# EAGLE design Micro Control Board - V130 (EAGLE 7.7.0)
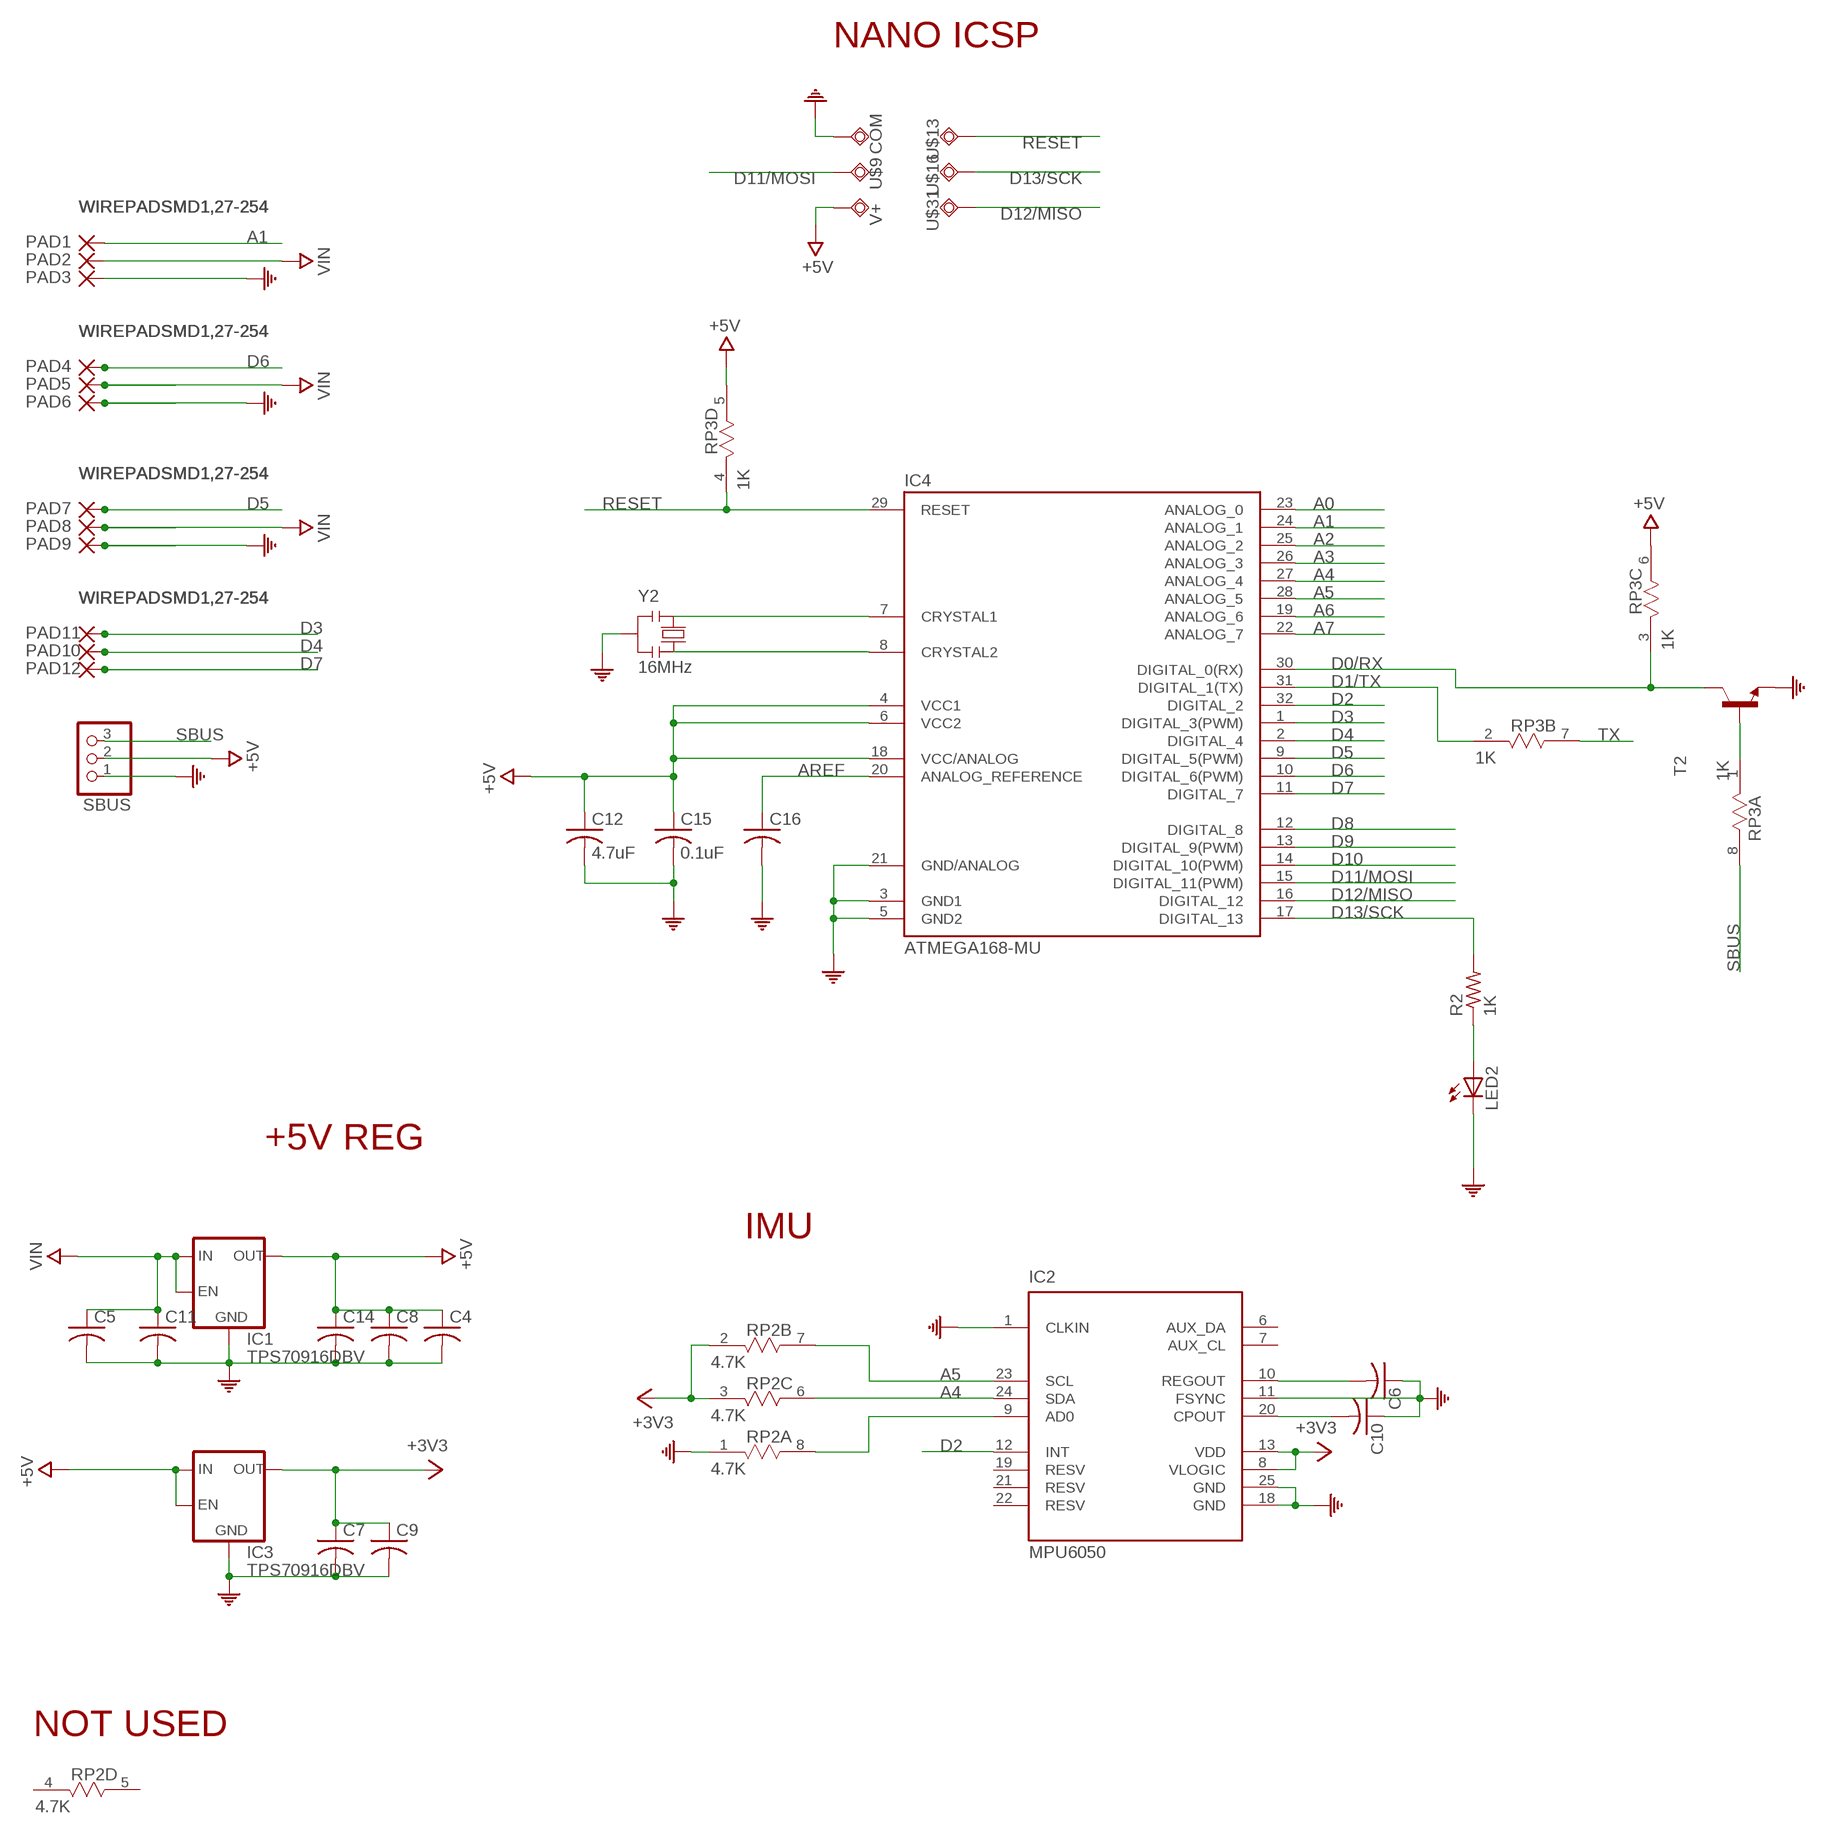
[diagram p0: schematic, sheet 1]

## Parts
C4  C-USC0402  [C0402]
C5  C-USC0402  [C0402]
C6  C-USC0402  [C0402]
C7  C-USC0402  [C0402]
C8  C-USC0402  [C0402]
C9  C-USC0402  [C0402]
C10  C-USC0402  [C0402]
C11  C-USC0402  [C0402]
C12  4.7uF  C-USC0402  [C0402]
C14  C-USC0402  [C0402]
C15  0.1uF  C-USC0402  [C0402]
C16  C-USC0402  [C0402]
COM  0.7MM-THRU  [0.65MM-THRU]
IC1  TPS70916DBV  [SOT23-5]
IC2  MPU6050  [QFN50P400X400X95-25T265X275N]
IC3  TPS70916DBV  [SOT23-5]
IC4  ATMEGA168-MU  [MLF32]
LED2  LEDCHIP-LED0603  [CHIP-LED0603]
PAD1  WIREPADSMD1,27-254  [SMD1,27-2,54]
PAD2  WIREPADSMD1,27-254  [SMD1,27-2,54]
PAD3  WIREPADSMD1,27-254  [SMD1,27-2,54]
PAD4  WIREPADSMD1,27-254  [SMD1,27-2,54]
PAD5  WIREPADSMD1,27-254  [SMD1,27-2,54]
PAD6  WIREPADSMD1,27-254  [SMD1,27-2,54]
PAD7  WIREPADSMD1,27-254  [SMD1,27-2,54]
PAD8  WIREPADSMD1,27-254  [SMD1,27-2,54]
PAD9  WIREPADSMD1,27-254  [SMD1,27-2,54]
PAD10  WIREPADSMD1,27-254  [SMD1,27-2,54]
PAD11  WIREPADSMD1,27-254  [SMD1,27-2,54]
PAD12  WIREPADSMD1,27-254  [SMD1,27-2,54]
R2  1K  R-US_R0402  [R0402]
RP2  4.7K  RES4NT  [RES4NT]
RP3  1K  RES4NT  [RES4NT]
SBUS  PINHD-1X3  [1X03]
T2  MMBT3904LT1-NPN-SOT23-BEC  [SOT23-BEC]
U$9  0.7MM-THRU  [0.65MM-THRU]
U$13  0.7MM-THRU  [0.65MM-THRU]
U$16  0.7MM-THRU  [0.65MM-THRU]
U$31  0.7MM-THRU  [0.65MM-THRU]
V+  0.7MM-THRU  [0.65MM-THRU]
Y2  16MHz  RESONATORMU  [RESONATOR]

## Nets
+3V3: C7.1 C9.1 IC2.8(VLOGIC) IC2.13(VDD) IC3.5(OUT) RP2.2 RP2.3
+5V: C4.1 C8.1 C12.1 C14.1 C15.1 IC1.5(OUT) IC3.1(IN) IC3.3(EN) IC4.4(VCC1) IC4.6(VCC2) IC4.18(VCC/ANALOG) RP3.5 RP3.6 SBUS.2 V+.P$2(TP)
A0: IC4.23(ANALOG_0)
A1: IC4.24(ANALOG_1) PAD1.1(P)
A2: IC4.25(ANALOG_2)
A3: IC4.26(ANALOG_3)
A4: IC2.24(SDA) IC4.27(ANALOG_4) RP2.6
A5: IC2.23(SCL) IC4.28(ANALOG_5) RP2.7
A6: IC4.19(ANALOG_6)
A7: IC4.22(ANALOG_7)
AREF: C16.1 IC4.20(ANALOG_REFERENCE)
COM: C4.2 C5.2 C6.1 C7.2 C8.2 C9.2 C10.1 C11.2 C12.2 C14.2 C15.2 C16.2 COM.P$2(TP) IC1.2(GND) IC2.1(CLKIN) IC2.11(FSYNC) IC2.18(GND) IC2.25(GND) IC3.2(GND) IC4.3(GND1) IC4.5(GND2) IC4.21(GND/ANALOG) LED2.C PAD3.1(P) PAD6.1(P) PAD9.1(P) RP2.1 SBUS.1 T2.E Y2.2
D0/RX: IC4.30(DIGITAL_0(RX)) RP3.3 T2.C
D1/TX: IC4.31(DIGITAL_1(TX)) RP3.2
D2: IC2.12(INT) IC4.32(DIGITAL_2)
D3: IC4.1(DIGITAL_3(PWM)) PAD10.1(P)
D4: IC4.2(DIGITAL_4) PAD11.1(P)
D5: IC4.9(DIGITAL_5(PWM)) PAD7.1(P)
D6: IC4.10(DIGITAL_6(PWM)) PAD4.1(P)
D7: IC4.11(DIGITAL_7) PAD12.1(P)
D8: IC4.12(DIGITAL_8)
D9: IC4.13(DIGITAL_9(PWM))
D10: IC4.14(DIGITAL_10(PWM))
D11/MOSI: IC4.15(DIGITAL_11(PWM)) U$9.P$2(TP)
D12/MISO: IC4.16(DIGITAL_12) U$31.P$2(TP)
D13/SCK: IC4.17(DIGITAL_13) R2.2 U$16.P$2(TP)
N$3: IC2.9(AD0) RP2.8
N$4: C6.2 IC2.10(REGOUT)
N$5: IC4.7(CRYSTAL1) Y2.1
N$6: C10.2 IC2.20(CPOUT)
N$7: IC4.8(CRYSTAL2) Y2.3
N$8: LED2.A R2.1
N$9: RP3.1 T2.B
RESET: IC4.29(RESET) RP3.4 U$13.P$2(TP)
SBUS: RP3.8 SBUS.3
TX: RP3.7
VIN: C5.1 C11.1 IC1.1(IN) IC1.3(EN) PAD2.1(P) PAD5.1(P) PAD8.1(P)
Unconnected: IC2.2(NC) IC2.3(NC) IC2.4(NC) IC2.5(NC) IC2.6(AUX_DA) IC2.7(AUX_CL) IC2.14(NC) IC2.15(NC) IC2.16(NC) IC2.17(NC) IC2.19(RESV) IC2.21(RESV) IC2.22(RESV) RP2.4 RP2.5

## Notes on the sheet
- NANO ICSP
- +5V REG
- IMU
- NOT USED

## Library data of the parts
C4-C12 C14-C16 = resistor:C-US: CAPACITOR, American symbol
COM U$9 U$13 U$16 U$31 V+ = testpad:0.7MM-THRU
IC1 IC3 = tps709xx_10:TPS709*: TPS709xx 150-mA, 30-V, 1-μA IQ Voltage Regulators with Enable Source: http://www.ti.com/lit/ds/symlink/tps709.pdf; MF: Texas Instruments; MPN: TPS70916DBVT; OC_FARNELL: 2314371; OC_NEWARK: 69W6893
IC2 = invensense:MPU6050: The triple-axis MEMS gyroscope
IC4 = Arduino-AVR:ATMEGA168
LED2 = led:LED: LED OSRAM: - CHIPLED LG R971, LG N971, LY N971, LG Q971, LY Q971, LO R971, LY R971 LH N974, LH R974 LS Q976, LO Q976, LY Q976 LO Q996 - Hyper CHIPLED LW Q18S LB Q993, LB Q99A, LB R99A - SideLED LS A670, LO A670, LY A670, LG A670, LP A670 LB A673, LV A673, LT A673, LW A673 LH A674 LY A675 LS A676, LA A676, LO A676, LY A676, LW A676 LS A679, LY A679, LG A679 - Hyper Micro SIDELED® LS Y876, LA Y876, LO Y876, LY Y876 LT Y87S - SmartLED LW L88C, LW L88S LB L89C, LB L89S, LG L890 LS L89K, LO L89K, LY L89K LS L896, LA L896, LO L896, LY L896 - TOPLED LS T670, LO T670, LY T670, LG T670, LP T670 LSG T670, LSP T670, LSY T670, LOP T670, LYG T670 LG T671, LOG T671, LSG T671 LB T673, LV T673, LT T673, LW T673 LH T674 LS T676, LA T676, LO T676, LY T676, LB T676, LH T676, LSB T676, LW T676 LB T67C, LV T67C, LT T67C, LS T67K, LO T67K, LY T67K, LW E67C LS E67B, LA E67B, LO E67B, LY E67B, LB E67C, LV E67C, LT E67C LW T67C LS T679, LY T679, LG T679 LS T770, LO T770, LY T770, LG T770, LP T770 LB T773, LV T773, LT T773, LW T773 LH T774 LS E675, LA E675, LY E675, LS T675 LS T776, LA T776, LO T776, LY T776, LB T776 LHGB T686 LT T68C, LB T68C - Hyper Mini TOPLED® LB M676 - Mini TOPLED Santana® LG M470 LS M47K, LO M47K, LY M47K Source: http://www.osram.convergy.de LUXEON: - LUMILED® LXK2-PW12-R00, LXK2-PW12-S00, LXK2-PW14-U00, LXK2-PW14-V00 LXK2-PM12-R00, LXK2-PM12-S00, LXK2-PM14-U00 LXK2-PE12-Q00, LXK2-PE12-R00, LXK2-PE12-S00, LXK2-PE14-T00, LXK2-PE14-U00 LXK2-PB12-K00, LXK2-PB12-L00, LXK2-PB12-M00, LXK2-PB14-N00, LXK2-PB14-P00, LXK2-PB14-Q00 LXK2-PR12-L00, LXK2-PR12-M00, LXK2-PR14-Q00, LXK2-PR14-R00 LXK2-PD12-Q00, LXK2-PD12-R00, LXK2-PD12-S00 LXK2-PH12-R00, LXK2-PH12-S00 LXK2-PL12-P00, LXK2-PL12-Q00, LXK2-PL12-R00 Source: www.luxeon.com KINGBRIGHT: KA-3528ASYC Source: www.kingbright.com
PAD1-PAD12 = wirepad:WIREPAD: Wire PAD connect wire on PCB
R2 = resistor:R-US_: RESISTOR, American symbol
RP2 RP3 = MySMD:RES4NT
SBUS = pinhead:PINHD-1X3: PIN HEADER
T2 = transistor-neu-to92:*-NPN-: NPN Transistror
Y2 = MySMD2:RESONATOR

## Board
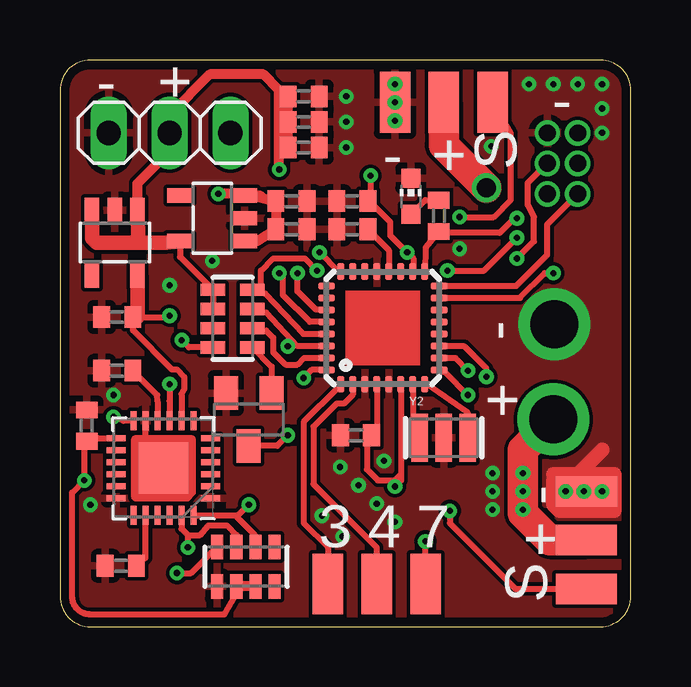
[diagram p1: board, top side]
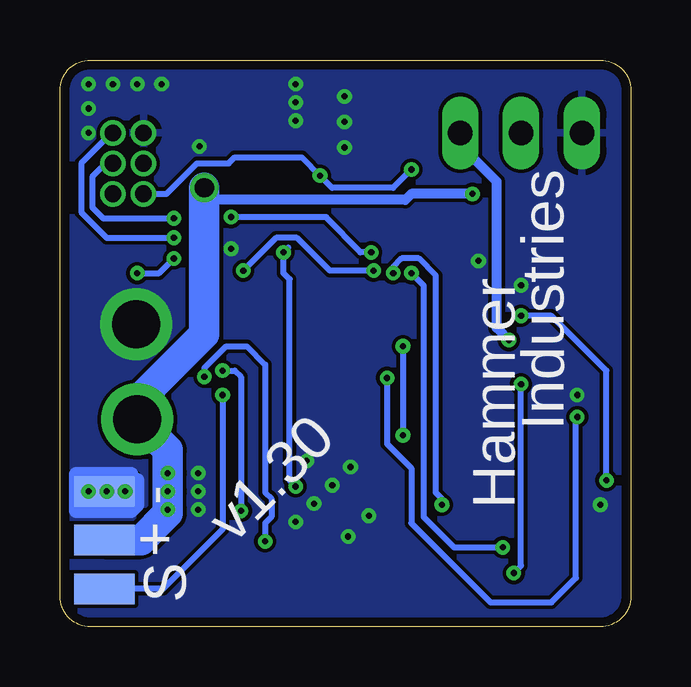
[diagram p2: board, bottom side, seen from below]

Size 23.8 x 23.61 mm. Coordinates in mm from the lower left corner, seen from the top.
Outline: 1.27,0 22.53,0 arc90 23.8,1.27 23.8,22.34 arc90 22.53,23.61 1.27,23.61 arc90 0,22.34 0,1.27 arc90 1.27,0
Copper layers (1*16): Top 0.0356mm / dielectric 1.5011mm / Bottom 0.0356mm
Design rules "oshpark-2layer *": minimum track width 6mil, minimum drill 10mil, track to track 6mil, track to pad 6mil, pad to pad 6mil, via to via 6mil, smd to smd 6mil, copper to edge 15mil, drill to drill 6mil, minimum pad ring 7mil, minimum via ring 7mil, stop-mask expansion 2.5mil, vias tented up to drill 25mil, thermal gap 10mil

### Footprints (pad centres in the part's own frame; a part is rotated, then mirrored left to right if it is on the bottom)
C0402 = smd 0.7 x 0.9: 1 -0.65,0; 2 0.65,0
0.65MM-THRU = drill 0.7 pad 1.016: P$2 0,0
SOT23-5 = smd 0.6 x 1.05: 1 -0.95,-1.35; 2 0,-1.35; 3 0.95,-1.35; 4 0.95,1.35; 5 -0.95,1.35
QFN50P400X400X95-25T265X275N = smd 0.26 x 0.79: 1 -1.25,-1.97; 2 -0.75,-1.97; 3 -0.25,-1.97; 4 0.25,-1.97; 5 0.75,-1.97; 6 1.25,-1.97; 13 1.25,1.97; 14 0.75,1.97; 15 0.25,1.97; 16 -0.25,1.97; 17 -0.75,1.97; 18 -1.25,1.97 | smd 0.79 x 0.26: 7 1.97,-1.25; 8 1.97,-0.75; 9 1.97,-0.25; 10 1.97,0.25; 11 1.97,0.75; 12 1.97,1.25; 19 -1.97,1.25; 20 -1.97,0.75; 21 -1.97,0.25; 22 -1.97,-0.25; 23 -1.97,-0.75; 24 -1.97,-1.25 | smd 2.15 x 2.05: 25 0,0
MLF32 = smd 0.7 x 0.3: 1 -2.35,1.75; 2 -2.35,1.25; 3 -2.35,0.75; 4 -2.35,0.25; 5 -2.35,-0.25; 6 -2.35,-0.75; 7 -2.35,-1.25; 8 -2.35,-1.75; 17 2.35,-1.75; 18 2.35,-1.25; 19 2.35,-0.75; 20 2.35,-0.25; 21 2.35,0.25; 22 2.35,0.75; 23 2.35,1.25; 24 2.35,1.75 | smd 0.3 x 0.7: 9 -1.75,-2.35; 10 -1.25,-2.35; 11 -0.75,-2.35; 12 -0.25,-2.35; 13 0.25,-2.35; 14 0.75,-2.35; 15 1.25,-2.35; 16 1.75,-2.35; 25 1.75,2.35; 26 1.25,2.35; 27 0.75,2.35; 28 0.25,2.35; 29 -0.25,2.35; 30 -0.75,2.35; 31 -1.25,2.35; 32 -1.75,2.35
CHIP-LED0603 = smd 0.8 x 0.8: A 0,-0.75; C 0,0.75
SMD1,27-2,54 = smd 1.27 x 2.54: 1 0,0
R0402 = smd 0.7 x 0.9: 1 -0.65,0; 2 0.65,0
RES4NT = smd 0.508 x 1.016: 1 0,0; 2 0.8,0; 3 1.6,0; 4 2.4,0; 5 2.4,1.651; 6 1.6,1.651; 7 0.8,1.651; 8 0,1.651
1X03 = drill 1.016 long: 1 -2.54,0; 2 0,0; 3 2.54,0
SOT23-BEC = smd 1 x 1.4: B -0.95,-1.1; C 0,1.1; E 0.95,-1.1
RESONATOR = smd 0.7 x 2: 1 -1,0; 2 0,0; 3 1,0

### Placement (x,y rotation side)
C4  10.16,19.96 0 top
C5  9.65,16.56 0 top
C6  2.39,10.67 0 top
C7  2.39,12.9 180 top
C8  10.16,21.03 0 top
C9  1.12,8.38 90 top
C10  2.54,2.54 0 top
C11  9.65,17.73 0 top
C12  12.34,7.98 180 top
C14  10.16,22.1 0 top
C15  12.19,17.73 180 top
C16  12.19,16.56 180 top
COM  20.32,20.57 0 top
IC1  6.35,17.02 90 top
IC2  4.32,6.6 90 top
IC3  2.29,16 180 top
IC4  13.46,12.45 90 top
LED2  14.63,17.93 0 top
PAD1  18.03,21.84 0 top
PAD2  16,21.84 0 top
PAD3  13.97,21.84 0 top
PAD4  21.95,1.57 90 top
PAD5  21.95,3.61 90 top
PAD6  21.95,5.64 90 top
PAD7  21.95,1.57 90 bottom
PAD8  21.95,3.61 90 bottom
PAD9  21.95,5.64 90 bottom
PAD10  11.18,1.78 0 top
PAD11  13.21,1.78 0 top
PAD12  15.24,1.78 0 top
R2  15.8,17.12 270 top
RP2  6.55,1.68 0 top
RP3  8.03,11.63 90 top
SBUS  4.57,20.57 0 top
T2  7.87,8.64 180 top
U$9  20.32,19.3 0 top
U$13  21.59,20.57 0 top
U$16  21.59,19.3 0 top
U$31  21.59,18.03 0 top
V+  20.32,18.03 0 top
Y2  16,7.87 0 top

### Tracks (layer width: path | path; a pad name or v marks a point on that pad's centre or on a via)
+3V3  (via drill 0.25)
  Top 0.254: IC2.13 1.59,7.85 C9.1 1.02,7.43 v1.02,6.1 0.51,5.59 0.51,1.27 arc90 1.27,0.51 6.86,0.51 7.37,1.37 7.37,1.66 RP2.2 | IC2.8 5.07,9.69 5.18,9.91 5.18,10.41 4.88,10.72 4.66,10.72 3.05,12.34 3.04,12.46 C7.1 4.52,12.9 v4.57,12.95
  Top 0.406: RP2.3 RP2.2
  Top 0.61: IC3.5 3.24,12.9 C7.1
  Bottom 0.254: v1.02,6.1 1.02,10.67 3.3,12.95 v4.57,12.95
+5V  (via drill 0.25)
  Top 0.254: IC4.4 13.21,8.27 C12.1 12.8,7.88 12.8,6.55 13.26,6.1 13.97,6.1 14.22,6.35 | IC4.6 14.22,10.08 14.22,6.35 | 14.22,6.35 14.22,6.1 v13.97,5.84 | C15.1 12.9,17.73 | 12.9,17.73 13.77,16.87 13.77,16.31 v14.48,15.6 14.73,15.34 14.73,14.82 IC4.18 | RP3.6 RP3.5 5,15.41 IC1.5 | v12.95,18.8 12.95,17.87 12.9,17.82 12.9,17.73
  Top 0.406: IC3.1 3.24,18.48 4.57,19.81 SBUS.2 4.57,21.34 6.25,23.01 8.48,23.01 9.14,22.35 | C4.1 C8.1 C14.1 9.4,21.59 9.14,22.35 | v9.14,19.05 9.14,22.35
  Top 0.61: IC3.3 1.34,16.19 1.52,16 3.25,16 | 3.25,16 3.25,16.07 IC3.1 | 3.25,16 4.43,16 IC1.5
  Bottom 0.254: v9.14,19.05 9.91,18.29 12.45,18.29 v12.95,18.8 13.72,19.56 16.51,19.56 16.76,19.3 18.09,19.3 19.36,18.03 V+.P$2 | v13.97,5.84 14.22,6.1 14.22,14.48 14.48,14.73 v14.48,15.6 14.28,15.8
A1  (via drill 0.25)
  Top 0.254: IC4.24 11.62,14.8 v10.82,15.6 | v16.66,17.07 18.09,17.07 18.8,17.78 18.8,20.57 PAD1.1
  Bottom 0.254: v10.82,15.6 11.28,15.6 12.7,17.07 v16.66,17.07
A4  (via drill 0.25)
  Top 0.254: IC2.24 7.3,4.63 | 7.3,4.63 8.13,3.81 8.13,3.1 RP2.6 | 7.3,4.63 7.43,4.63 v7.87,5.08 | IC4.27 10.67,13.21 9.91,13.97 v9.91,14.73
  Bottom 0.254: v7.87,5.08 7.87,5.33 8.13,5.59 8.13,14.63 8.84,15.34 9.55,15.34 9.91,14.99 v9.91,14.73
A5  (via drill 0.25)
  Top 0.254: IC2.23 5.07,4.08 5.33,3.81 | 5.33,3.81 5.84,3.81 6.2,4.22 6.96,4.22 7.37,3.81 7.37,3.09 RP2.7 | IC4.28 10.42,12.7 9.3,13.82 9.3,14.58 v9.14,14.73 | v5.33,3.3 5.33,3.81
  Bottom 0.254: v9.14,14.73 8.64,14.22 8.64,4.57 7.37,3.3 v5.33,3.3
AREF
  Top 0.254: C16.1 13.71,15.69 IC4.20
COM  (via drill 0.25, 2)
  Top 0.254: IC2.11 3.56,8.56 3.56,7.37 IC2.25
  Top 0.61: 21.59,6.35 23.11,6.35 23.11,4.83 20.83,4.83 20.57,5.08 20.57,6.1 | 20.57,6.35 21.59,6.35 | 21.59,6.35 22.61,7.37
  Bottom 0.61: 20.83,6.35 23.11,6.35 23.11,4.83 20.83,4.83 20.57,5.08 20.57,6.1 21.03,5.64 v21.08,5.64
  other vias: 20.62,12.6 2.24,9.65 1.27,5.08 4.57,14.22 13.51,6.91 10.92,4.62 11.79,3.76 18.03,6.4 11.68,6.65 17.98,20.02 21.84,5.64 22.61,5.64 18.03,5.64 18.03,4.88 16.66,15.75 12.45,5.89 13.21,5.13 13.97,4.37 6.35,15.24 11.94,22.1 11.94,21.03 11.94,19.96 13.97,22.61 13.97,21.84 13.97,21.08 19.56,22.61 20.57,22.61 21.59,22.61 22.61,22.61 22.61,21.59 22.61,20.57
  pour Bottom: 23.88,23.11 0,23.11 0,0 23.88,0
  pour Top: 0,0 0,23.11 23.88,23.11 23.88,0
D0/RX  (via drill 0.25)
  Top 0.254: RP3.3 8.61,13.08 9.89,11.7 | 9.89,11.7 IC4.30 | 9.89,11.7 9.63,11.68 v9.5,11.68 | v9.5,7.98 9.06,7.54 T2.C
  Bottom 0.254: v9.5,11.68 v9.5,7.98
D1/TX
  Top 0.254: RP3.2 8.6,12.33 8.89,12.04 8.89,11.43 9.4,10.92 9.91,10.92 10.18,11.2 IC4.31
D2  (via drill 0.25)
  Top 0.254: IC2.12 2.65,8.57 v2.23,8.74 | IC4.32 10.49,10.7 v10.16,10.36
  Bottom 0.254: v10.16,10.36 10.16,7.62 9.14,6.6 9.14,4.32 5.84,1.02 3.3,1.02 2.29,2.03 2.29,8.53 v2.23,8.74
D3
  Top 0.254: IC4.1 11.57,9.94 10.16,8.53 10.16,4.32 11.18,3.3 PAD10.1
D4
  Top 0.254: IC4.2 12.21,9.67 11.84,9.3 11.53,9.3 10.57,8.33 10.57,5.94 13.21,3.3 PAD11.1
D5  (via drill 0.25)
  Top 0.254: IC4.9 16.07,10.6 v17.02,9.65
  Bottom 0.254: v17.02,9.65 17.02,4.06 19.51,1.57 PAD7.1
D6  (via drill 0.25)
  Top 0.254: IC4.10 16.49,11.2 v17.02,10.67 | v16.26,4.83 16.26,4.32 19,1.57 PAD4.1
  Bottom 0.254: v17.02,10.67 16.51,10.67 16.26,10.41 v16.26,4.83
D7  (via drill 0.25)
  Top 0.254: PAD12.1 v15.24,3.56 | v17.78,10.41 17.78,10.77 16.87,11.68 15.82,11.68 IC4.11
  Bottom 0.254: v17.78,10.41 17.78,10.77 16.87,11.68 16,11.68 15.24,10.92 15.24,5.59 14.99,5.33 14.99,4.57 15.24,4.32 v15.24,3.56
D11/MOSI  (via drill 0.25)
  Top 0.254: IC4.15 19.18,13.7 20.22,14.73 v20.57,14.73 | v19.05,15.34 19.76,16.05 19.76,17.07 19.51,17.58 19.51,18.49 U$9.P$2
  Bottom 0.254: v20.57,14.73 19.66,14.73 v19.05,15.34
D12/MISO
  Top 0.254: IC4.16 19.02,14.2 20.32,15.49 20.32,16.76 U$31.P$2
D13/SCK  (via drill 0.25)
  Top 0.254: IC4.17 15.24,15.79 R2.2 15.94,16.41 18.34,16.41 18.95,17.02 v19.05,17.02
  Bottom 0.254: U$16.P$2 21.89,19.3 22.45,18.75 22.45,17.48 22,17.02 v19.05,17.02
N$3  (via drill 0.25)
  Top 0.254: v4.57,10.11 4.57,9.39 IC2.9 | v4.88,2.23 5.46,2.23 RP2.8
  Bottom 0.254: v4.88,2.23 4.57,2.54 v4.57,10.11
N$4
  Top 0.254: IC2.10 4.06,9.4 4.05,9.65 C6.2
N$5
  Top 0.254: IC4.7 14.71,8.67 Y2.1
N$6
  Top 0.254: C10.2 3.57,2.87 IC2.20
N$7
  Top 0.254: Y2.3 17,8.91 15.3,10.1 IC4.8
N$8
  Top 0.254: LED2.A 15.24,17.77 R2.1
N$9
  Top 0.254: RP3.1 8.82,10.84 T2.B
RESET  (via drill 0.25)
  Top 0.254: IC4.29 10.16,12.2 8.57,13.88 RP3.4 8.09,13.97 8.38,13.97 8.38,14.83 8.89,15.34 10.21,15.34 v10.72,14.83 | v16.15,14.83 17.68,14.83 v19.05,16.2
  Bottom 0.254: v10.72,14.83 12.55,14.83 13.92,16.2 14.78,16.2 v16.15,14.83 | U$13.P$2 21.64,20.57 22.91,19.3 22.91,17.27 21.84,16.2 v19.05,16.2
SBUS  (via drill 0.25)
  Top 0.254: 6.66,11.63 RP3.8 5.38,11.63 v5.08,11.94
  Bottom 0.406: v5.08,11.94 5.59,12.45 5.59,18.54 7.11,20.07 SBUS.3
VIN  (via drill 0.25, 0.8, 2)
  Top 0.254: C11.1 8.69,17.73 8.38,18.03 7.37,18.03
  Top 0.406: IC1.3 7.97,17.97 C11.1 C5.1 8.23,16.07 IC1.1 | 7.37,18.03 v6.6,18.03
  Top 1.27: PAD2.1 16,20.07 v17.78,18.29 | v20.57,8.64 19.3,7.37 v19.3,6.4 v19.3,5.64 v19.3,4.88 19.3,4.72 20.42,3.61 PAD5.1
  Bottom 0.406: v6.6,18.03 9.14,18.03 9.4,17.78 17.53,17.78 v17.78,18.29
  Bottom 1.27: v17.78,18.29 17.78,12.19 20.57,9.4 v20.57,8.64 | v20.57,8.64 20.07,9.65 | PAD5.1 20.42,3.61 19.3,4.72 v19.3,4.88 v19.3,5.64 v19.3,6.4 19.3,7.37 v20.57,8.64

### Text on the board
tPlace: - | - | +
bPlace: Industries | Hammer | v1.30
tNames: - | + | - | + | S | 3 | 4 | 7 | - | + | S
bNames: - | + | S
Document: - | + | S | + | -